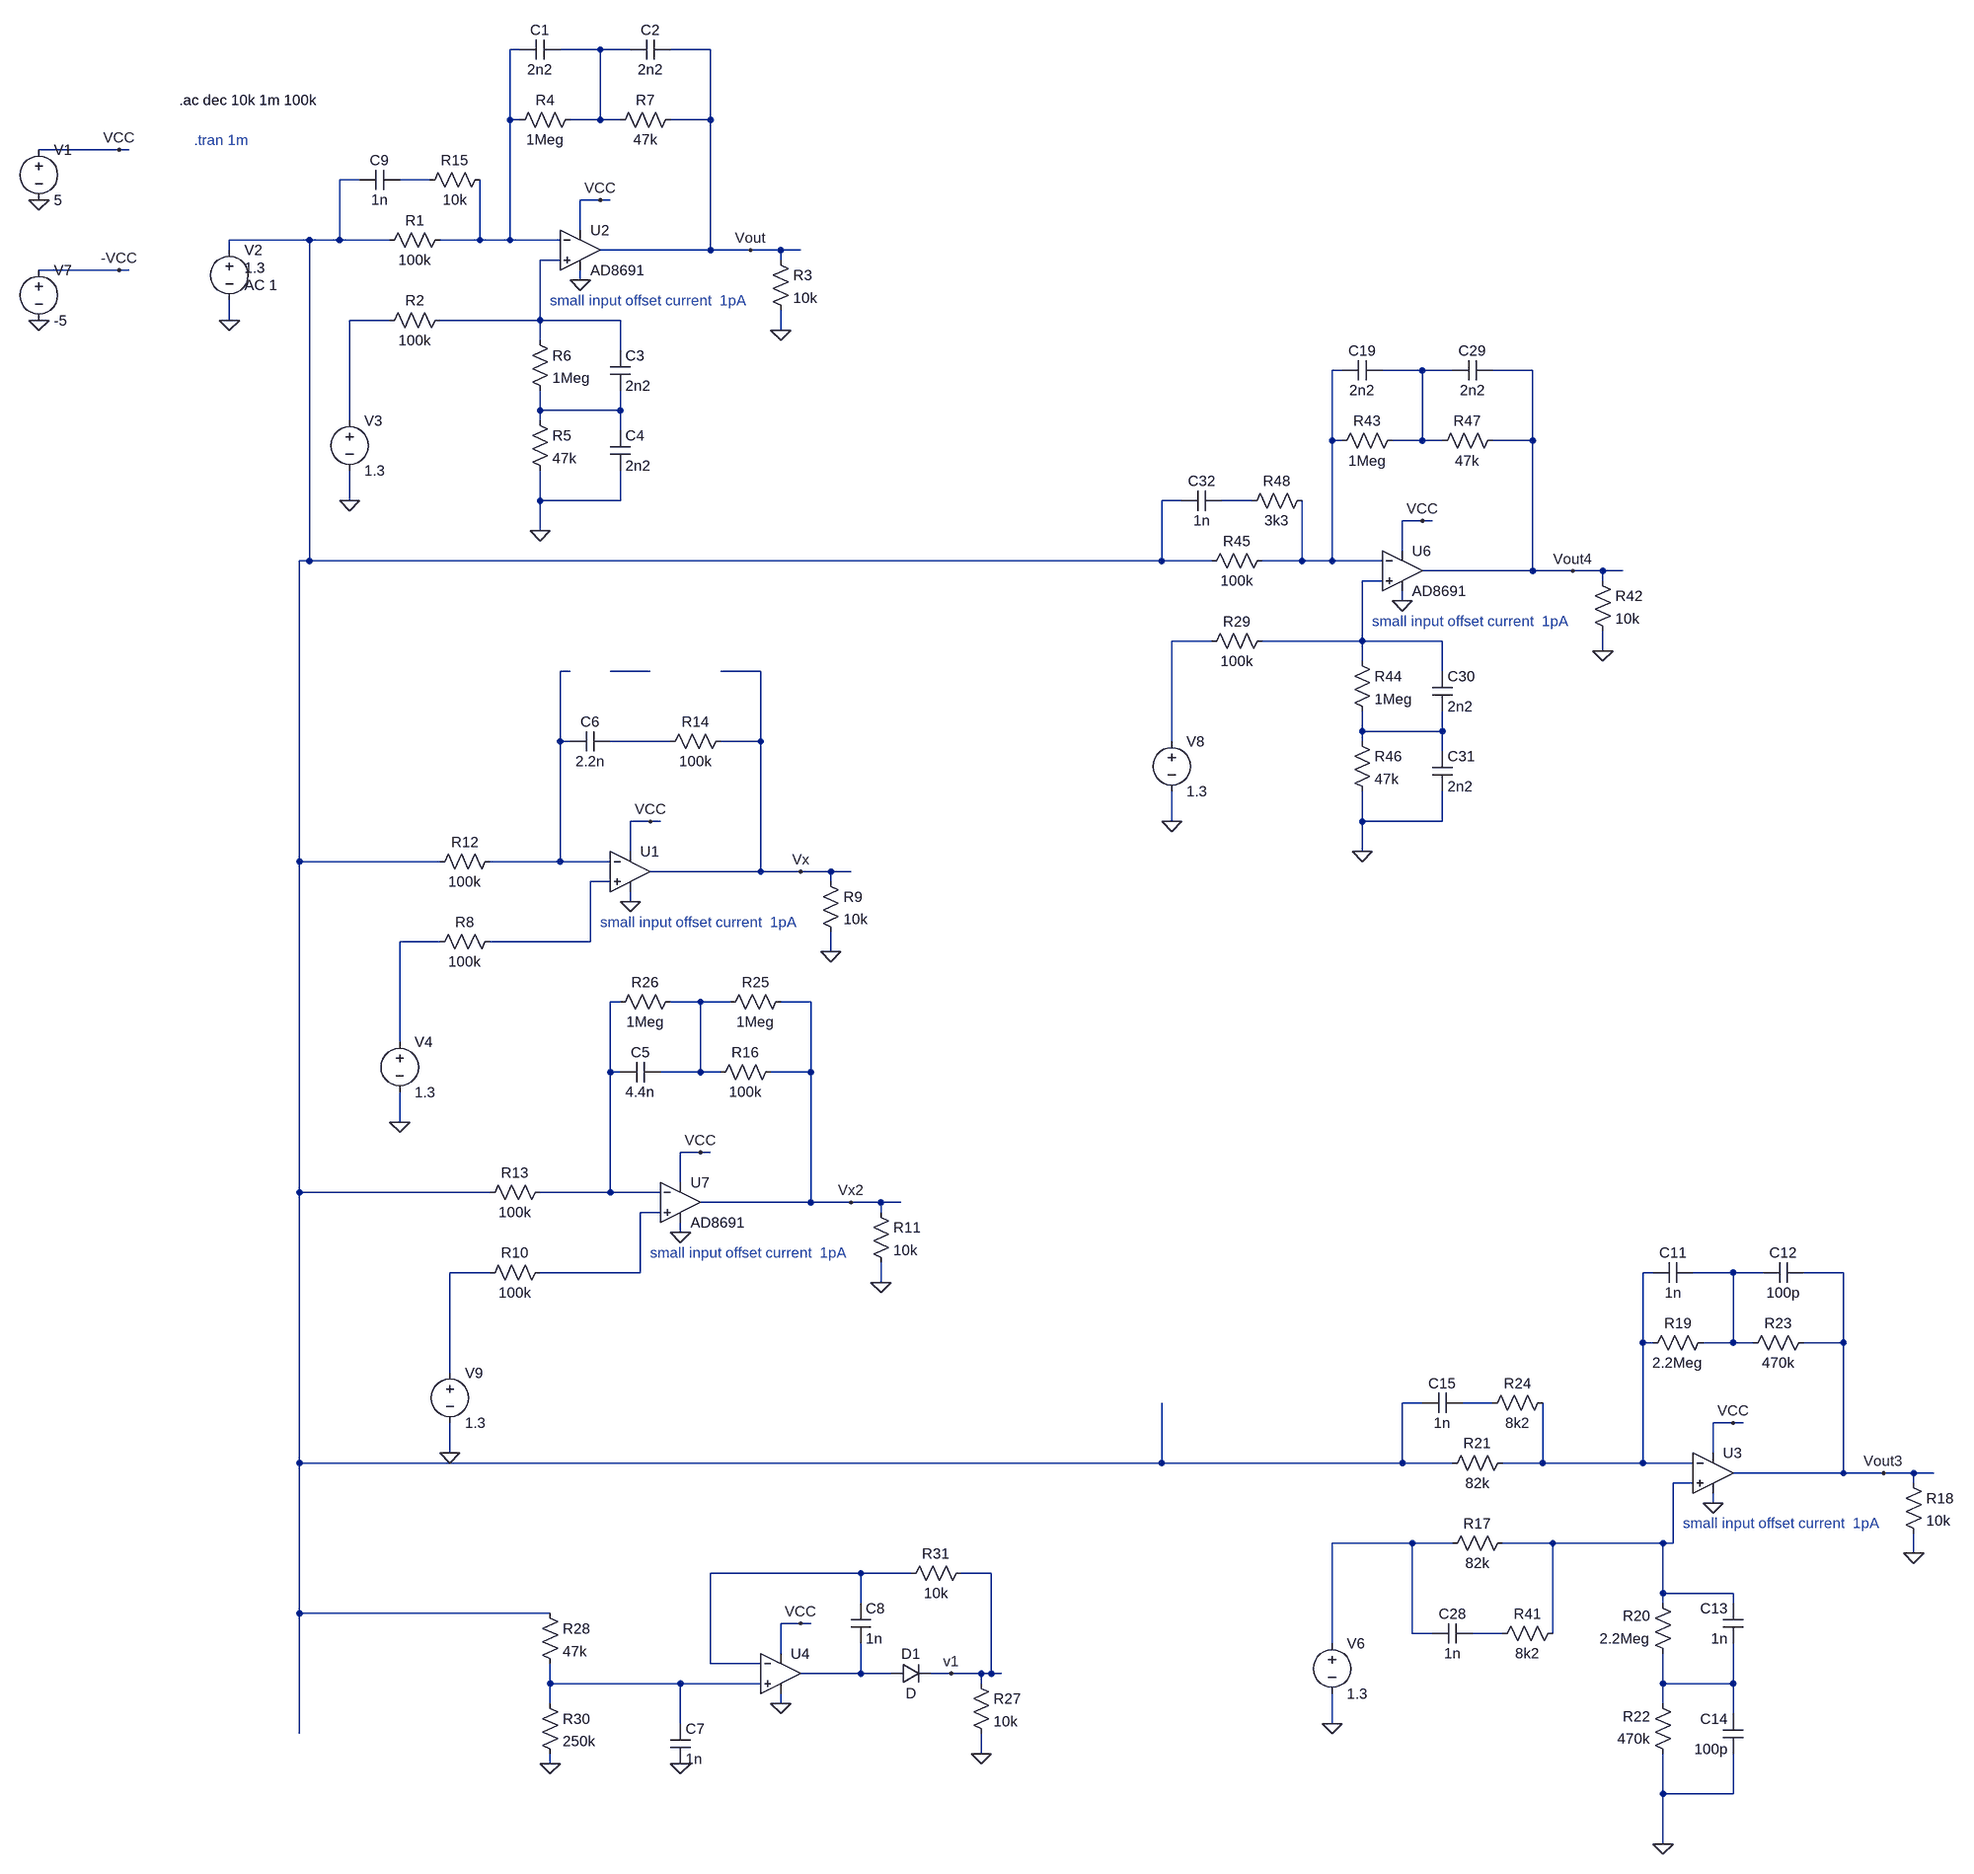
[diagram p0: schematic current controller.asc]
current controller.asc, the LTspice schematic file:
Version 4
SHEET 1 1892 2836
WIRE -400 -336 -416 -336
WIRE -272 -336 -336 -336
WIRE -224 -336 -272 -336
WIRE -96 -336 -160 -336
WIRE -416 -224 -416 -336
WIRE -400 -224 -416 -224
WIRE -272 -224 -272 -336
WIRE -272 -224 -320 -224
WIRE -240 -224 -272 -224
WIRE -96 -224 -96 -336
WIRE -96 -224 -160 -224
WIRE -1040 -176 -1168 -176
WIRE -1024 -176 -1040 -176
WIRE -656 -128 -688 -128
WIRE -544 -128 -592 -128
WIRE -272 -96 -304 -96
WIRE -256 -96 -272 -96
WIRE -304 -48 -304 -96
WIRE -736 -32 -864 -32
WIRE -688 -32 -688 -128
WIRE -688 -32 -736 -32
WIRE -608 -32 -688 -32
WIRE -464 -32 -464 -128
WIRE -464 -32 -528 -32
WIRE -416 -32 -416 -224
WIRE -416 -32 -464 -32
WIRE -336 -32 -416 -32
WIRE -864 -16 -864 -32
WIRE -96 -16 -96 -224
WIRE -96 -16 -272 -16
WIRE -32 -16 -96 -16
WIRE 16 -16 -32 -16
WIRE 48 -16 16 -16
WIRE -336 0 -368 0
WIRE 16 0 16 -16
WIRE -1040 16 -1168 16
WIRE -1024 16 -1040 16
WIRE -304 32 -304 16
WIRE -864 96 -864 64
WIRE -608 96 -672 96
WIRE -368 96 -368 0
WIRE -368 96 -528 96
WIRE -240 96 -368 96
WIRE 16 112 16 80
WIRE -368 128 -368 96
WIRE -240 144 -240 96
WIRE 912 176 896 176
WIRE 1040 176 976 176
WIRE 1088 176 1040 176
WIRE 1216 176 1152 176
WIRE -368 240 -368 208
WIRE -240 240 -240 208
WIRE -240 240 -368 240
WIRE -672 256 -672 96
WIRE -368 256 -368 240
WIRE -240 272 -240 240
WIRE 896 288 896 176
WIRE 912 288 896 288
WIRE 1040 288 1040 176
WIRE 1040 288 992 288
WIRE 1072 288 1040 288
WIRE 1216 288 1216 176
WIRE 1216 288 1152 288
WIRE -672 384 -672 336
WIRE -368 384 -368 336
WIRE -240 384 -240 336
WIRE -240 384 -368 384
WIRE 656 384 624 384
WIRE 768 384 720 384
WIRE 1040 416 1008 416
WIRE 1056 416 1040 416
WIRE -368 432 -368 384
WIRE 1008 464 1008 416
WIRE -736 480 -736 -32
WIRE -736 480 -752 480
WIRE 624 480 624 384
WIRE 624 480 -736 480
WIRE 704 480 624 480
WIRE 848 480 848 384
WIRE 848 480 784 480
WIRE 896 480 896 288
WIRE 896 480 848 480
WIRE 976 480 896 480
WIRE 1216 496 1216 288
WIRE 1216 496 1040 496
WIRE 1280 496 1216 496
WIRE 1328 496 1280 496
WIRE 1360 496 1328 496
WIRE 976 512 944 512
WIRE 1328 512 1328 496
WIRE 1008 544 1008 528
WIRE 704 608 640 608
WIRE 944 608 944 512
WIRE 944 608 784 608
WIRE 1072 608 944 608
WIRE 1328 624 1328 592
WIRE 944 640 944 608
WIRE -320 656 -336 656
WIRE -192 656 -256 656
WIRE -16 656 -80 656
WIRE 1072 656 1072 608
WIRE 944 752 944 720
WIRE 1072 752 1072 720
WIRE 1072 752 944 752
WIRE -336 768 -336 656
WIRE -320 768 -336 768
WIRE -160 768 -256 768
WIRE -16 768 -16 656
WIRE -16 768 -80 768
WIRE 640 768 640 608
WIRE 944 768 944 752
WIRE 1072 784 1072 752
WIRE -192 896 -224 896
WIRE -176 896 -192 896
WIRE 640 896 640 848
WIRE 944 896 944 848
WIRE 1072 896 1072 848
WIRE 1072 896 944 896
WIRE -224 944 -224 896
WIRE 944 944 944 896
WIRE -752 960 -752 480
WIRE -528 960 -752 960
WIRE -336 960 -336 768
WIRE -336 960 -448 960
WIRE -256 960 -336 960
WIRE -16 976 -16 768
WIRE -16 976 -192 976
WIRE 48 976 -16 976
WIRE 96 976 48 976
WIRE 128 976 96 976
WIRE -256 992 -288 992
WIRE 96 992 96 976
WIRE -224 1024 -224 1008
WIRE -528 1088 -592 1088
WIRE -288 1088 -288 992
WIRE -288 1088 -448 1088
WIRE 96 1104 96 1072
WIRE -240 1184 -256 1184
WIRE -112 1184 -160 1184
WIRE -64 1184 -112 1184
WIRE 64 1184 16 1184
WIRE -592 1248 -592 1088
WIRE -256 1296 -256 1184
WIRE -240 1296 -256 1296
WIRE -112 1296 -112 1184
WIRE -112 1296 -176 1296
WIRE -80 1296 -112 1296
WIRE 64 1296 64 1184
WIRE 64 1296 0 1296
WIRE -592 1376 -592 1328
WIRE -112 1424 -144 1424
WIRE -96 1424 -112 1424
WIRE -144 1472 -144 1424
WIRE -752 1488 -752 960
WIRE -448 1488 -752 1488
WIRE -256 1488 -256 1296
WIRE -256 1488 -368 1488
WIRE -176 1488 -256 1488
WIRE 64 1504 64 1296
WIRE 64 1504 -112 1504
WIRE 128 1504 64 1504
WIRE 176 1504 128 1504
WIRE 208 1504 176 1504
WIRE -176 1520 -208 1520
WIRE 176 1520 176 1504
WIRE -144 1552 -144 1536
WIRE -448 1616 -512 1616
WIRE -208 1616 -208 1520
WIRE -208 1616 -368 1616
WIRE 1408 1616 1392 1616
WIRE 1536 1616 1472 1616
WIRE 1584 1616 1536 1616
WIRE 1712 1616 1648 1616
WIRE 176 1632 176 1600
WIRE 1392 1728 1392 1616
WIRE 1408 1728 1392 1728
WIRE 1536 1728 1536 1616
WIRE 1536 1728 1488 1728
WIRE 1568 1728 1536 1728
WIRE 1712 1728 1712 1616
WIRE 1712 1728 1648 1728
WIRE -512 1776 -512 1616
WIRE 1040 1824 1008 1824
WIRE 1152 1824 1104 1824
WIRE 1536 1856 1504 1856
WIRE 1552 1856 1536 1856
WIRE -512 1904 -512 1856
WIRE 1504 1904 1504 1856
WIRE -752 1920 -752 1488
WIRE 624 1920 624 1824
WIRE 624 1920 -752 1920
WIRE 1008 1920 1008 1824
WIRE 1008 1920 624 1920
WIRE 1088 1920 1008 1920
WIRE 1232 1920 1232 1824
WIRE 1232 1920 1168 1920
WIRE 1392 1920 1392 1728
WIRE 1392 1920 1232 1920
WIRE 1472 1920 1392 1920
WIRE 1712 1936 1712 1728
WIRE 1712 1936 1536 1936
WIRE 1776 1936 1712 1936
WIRE 1824 1936 1776 1936
WIRE 1856 1936 1824 1936
WIRE 1472 1952 1440 1952
WIRE 1824 1952 1824 1936
WIRE 1504 1984 1504 1968
WIRE 1024 2048 896 2048
WIRE 1088 2048 1024 2048
WIRE 1248 2048 1168 2048
WIRE 1424 2048 1248 2048
WIRE 1440 2048 1440 1952
WIRE 1440 2048 1424 2048
WIRE 1824 2064 1824 2032
WIRE 144 2096 -96 2096
WIRE 224 2096 144 2096
WIRE 352 2096 304 2096
WIRE 1424 2128 1424 2048
WIRE 1536 2128 1424 2128
WIRE 144 2144 144 2096
WIRE 1424 2144 1424 2128
WIRE 1536 2144 1536 2128
WIRE -752 2160 -752 1920
WIRE -352 2160 -752 2160
WIRE 48 2176 16 2176
WIRE 64 2176 48 2176
WIRE 1024 2192 1024 2048
WIRE 1056 2192 1024 2192
WIRE 1168 2192 1120 2192
WIRE 1248 2192 1248 2048
WIRE 896 2208 896 2048
WIRE 16 2224 16 2176
WIRE -96 2240 -96 2096
WIRE -16 2240 -96 2240
WIRE 144 2256 144 2208
WIRE 144 2256 48 2256
WIRE 192 2256 144 2256
WIRE 288 2256 256 2256
WIRE 336 2256 288 2256
WIRE 352 2256 352 2096
WIRE 352 2256 336 2256
WIRE 368 2256 352 2256
WIRE -352 2272 -352 2240
WIRE -144 2272 -352 2272
WIRE -16 2272 -144 2272
WIRE 336 2272 336 2256
WIRE 1424 2272 1424 2224
WIRE 1536 2272 1536 2208
WIRE 1536 2272 1424 2272
WIRE -352 2304 -352 2272
WIRE 16 2304 16 2288
WIRE 1424 2304 1424 2272
WIRE 1536 2320 1536 2272
WIRE -144 2336 -144 2272
WIRE 896 2336 896 2288
WIRE -752 2352 -752 2160
WIRE 336 2384 336 2352
WIRE -352 2400 -352 2384
WIRE 1424 2448 1424 2384
WIRE 1536 2448 1536 2384
WIRE 1536 2448 1424 2448
WIRE 1424 2528 1424 2448
FLAG -304 32 0
FLAG -272 -96 VCC
FLAG -1168 -96 0
FLAG 16 112 0
FLAG -32 -16 Vout
FLAG -672 384 0
FLAG -368 432 0
FLAG -864 96 0
FLAG -1040 -176 VCC
FLAG 1504 1984 0
FLAG 1536 1856 VCC
FLAG 1824 2064 0
FLAG 1776 1936 Vout3
FLAG 896 2336 0
FLAG 1424 2528 0
FLAG 1008 544 0
FLAG 1040 416 VCC
FLAG 1328 624 0
FLAG 1280 496 Vout4
FLAG 640 896 0
FLAG 944 944 0
FLAG -1168 96 0
FLAG -1040 16 -VCC
FLAG -224 1024 0
FLAG -192 896 VCC
FLAG 96 1104 0
FLAG 48 976 Vx
FLAG -592 1376 0
FLAG -144 1552 0
FLAG -112 1424 VCC
FLAG 176 1632 0
FLAG 128 1504 Vx2
FLAG -512 1904 0
FLAG 16 2304 0
FLAG 48 2176 VCC
FLAG 336 2384 0
FLAG 288 2256 v1
FLAG -352 2400 0
FLAG -144 2400 0
SYMBOL voltage -1168 -192 R0
WINDOW 123 0 0 Left 0
WINDOW 39 0 0 Left 0
SYMATTR InstName V1
SYMATTR Value 5
SYMBOL res -512 80 R90
WINDOW 0 0 56 VBottom 2
WINDOW 3 32 56 VTop 2
SYMATTR InstName R2
SYMATTR Value 100k
SYMBOL res 0 -16 R0
SYMATTR InstName R3
SYMATTR Value 10k
SYMBOL res -304 -240 R90
WINDOW 0 0 56 VBottom 2
WINDOW 3 32 56 VTop 2
SYMATTR InstName R4
SYMATTR Value 1Meg
SYMBOL voltage -672 240 R0
WINDOW 123 0 0 Left 0
WINDOW 39 0 0 Left 0
SYMATTR InstName V3
SYMATTR Value 1.3
SYMBOL res -384 112 R0
SYMATTR InstName R6
SYMATTR Value 1Meg
SYMBOL OpAmps\\AD8691 -304 -80 R0
SYMATTR InstName U2
SYMBOL res -512 -48 R90
WINDOW 0 0 56 VBottom 2
WINDOW 3 32 56 VTop 2
SYMATTR InstName R1
SYMATTR Value 100k
SYMBOL res -384 240 R0
SYMATTR InstName R5
SYMATTR Value 47k
SYMBOL res -144 -240 R90
WINDOW 0 0 56 VBottom 2
WINDOW 3 32 56 VTop 2
SYMATTR InstName R7
SYMATTR Value 47k
SYMBOL voltage -864 -32 R0
WINDOW 3 24 44 Left 2
WINDOW 123 24 72 Left 2
WINDOW 39 0 0 Left 0
SYMATTR Value 1.3
SYMATTR Value2 AC 1
SYMATTR InstName V2
SYMBOL cap -336 -352 R90
WINDOW 0 0 32 VBottom 2
WINDOW 3 32 32 VTop 2
SYMATTR InstName C1
SYMATTR Value 2n2
SYMBOL cap -160 -352 R90
WINDOW 0 0 32 VBottom 2
WINDOW 3 32 32 VTop 2
SYMATTR InstName C2
SYMATTR Value 2n2
SYMBOL cap -256 144 R0
SYMATTR InstName C3
SYMATTR Value 2n2
SYMBOL cap -256 272 R0
SYMATTR InstName C4
SYMATTR Value 2n2
SYMBOL cap -592 -144 R90
WINDOW 0 0 32 VBottom 2
WINDOW 3 32 32 VTop 2
SYMATTR InstName C9
SYMATTR Value 1n
SYMBOL res -448 -144 R90
WINDOW 0 0 56 VBottom 2
WINDOW 3 32 56 VTop 2
SYMATTR InstName R15
SYMATTR Value 10k
SYMBOL res 1184 2032 R90
WINDOW 0 0 56 VBottom 2
WINDOW 3 32 56 VTop 2
SYMATTR InstName R17
SYMATTR Value 82k
SYMBOL res 1808 1936 R0
SYMATTR InstName R18
SYMATTR Value 10k
SYMBOL res 1504 1712 R90
WINDOW 0 0 56 VBottom 2
WINDOW 3 32 56 VTop 2
SYMATTR InstName R19
SYMATTR Value 2.2Meg
SYMBOL voltage 896 2192 R0
WINDOW 123 0 0 Left 0
WINDOW 39 0 0 Left 0
SYMATTR InstName V6
SYMATTR Value 1.3
SYMBOL res 1184 1904 R90
WINDOW 0 0 56 VBottom 2
WINDOW 3 32 56 VTop 2
SYMATTR InstName R21
SYMATTR Value 82k
SYMBOL res 1664 1712 R90
WINDOW 0 0 56 VBottom 2
WINDOW 3 32 56 VTop 2
SYMATTR InstName R23
SYMATTR Value 470k
SYMBOL cap 1472 1600 R90
WINDOW 0 0 32 VBottom 2
WINDOW 3 32 32 VTop 2
SYMATTR InstName C11
SYMATTR Value 1n
SYMBOL cap 1648 1600 R90
WINDOW 0 0 32 VBottom 2
WINDOW 3 32 32 VTop 2
SYMATTR InstName C12
SYMATTR Value 100p
SYMBOL cap 1104 1808 R90
WINDOW 0 0 32 VBottom 2
WINDOW 3 32 32 VTop 2
SYMATTR InstName C15
SYMATTR Value 1n
SYMBOL res 1248 1808 R90
WINDOW 0 0 56 VBottom 2
WINDOW 3 32 56 VTop 2
SYMATTR InstName R24
SYMATTR Value 8k2
SYMBOL res 1440 2240 R180
WINDOW 0 36 76 Left 2
WINDOW 3 36 40 Left 2
SYMATTR InstName R20
SYMATTR Value 2.2Meg
SYMBOL res 1440 2400 R180
WINDOW 0 36 76 Left 2
WINDOW 3 36 40 Left 2
SYMATTR InstName R22
SYMATTR Value 470k
SYMBOL cap 1552 2208 R180
WINDOW 0 24 56 Left 2
WINDOW 3 24 8 Left 2
SYMATTR InstName C13
SYMATTR Value 1n
SYMBOL cap 1552 2384 R180
WINDOW 0 24 56 Left 2
WINDOW 3 24 8 Left 2
SYMATTR InstName C14
SYMATTR Value 100p
SYMBOL OpAmps\\UniversalOpAmp 1504 1936 R0
SYMATTR InstName U3
SYMBOL cap 1120 2176 R90
WINDOW 0 0 32 VBottom 2
WINDOW 3 32 32 VTop 2
SYMATTR InstName C28
SYMATTR Value 1n
SYMBOL res 1264 2176 R90
WINDOW 0 0 56 VBottom 2
WINDOW 3 32 56 VTop 2
SYMATTR InstName R41
SYMATTR Value 8k2
SYMBOL res 800 592 R90
WINDOW 0 0 56 VBottom 2
WINDOW 3 32 56 VTop 2
SYMATTR InstName R29
SYMATTR Value 100k
SYMBOL res 1312 496 R0
SYMATTR InstName R42
SYMATTR Value 10k
SYMBOL res 1008 272 R90
WINDOW 0 0 56 VBottom 2
WINDOW 3 32 56 VTop 2
SYMATTR InstName R43
SYMATTR Value 1Meg
SYMBOL voltage 640 752 R0
WINDOW 123 0 0 Left 0
WINDOW 39 0 0 Left 0
SYMATTR InstName V8
SYMATTR Value 1.3
SYMBOL res 928 624 R0
SYMATTR InstName R44
SYMATTR Value 1Meg
SYMBOL OpAmps\\AD8691 1008 432 R0
SYMATTR InstName U6
SYMBOL res 800 464 R90
WINDOW 0 0 56 VBottom 2
WINDOW 3 32 56 VTop 2
SYMATTR InstName R45
SYMATTR Value 100k
SYMBOL res 928 752 R0
SYMATTR InstName R46
SYMATTR Value 47k
SYMBOL res 1168 272 R90
WINDOW 0 0 56 VBottom 2
WINDOW 3 32 56 VTop 2
SYMATTR InstName R47
SYMATTR Value 47k
SYMBOL cap 976 160 R90
WINDOW 0 0 32 VBottom 2
WINDOW 3 32 32 VTop 2
SYMATTR InstName C19
SYMATTR Value 2n2
SYMBOL cap 1152 160 R90
WINDOW 0 0 32 VBottom 2
WINDOW 3 32 32 VTop 2
SYMATTR InstName C29
SYMATTR Value 2n2
SYMBOL cap 1056 656 R0
SYMATTR InstName C30
SYMATTR Value 2n2
SYMBOL cap 1056 784 R0
SYMATTR InstName C31
SYMATTR Value 2n2
SYMBOL cap 720 368 R90
WINDOW 0 0 32 VBottom 2
WINDOW 3 32 32 VTop 2
SYMATTR InstName C32
SYMATTR Value 1n
SYMBOL res 864 368 R90
WINDOW 0 0 56 VBottom 2
WINDOW 3 32 56 VTop 2
SYMATTR InstName R48
SYMATTR Value 3k3
SYMBOL voltage -1168 0 R0
WINDOW 123 0 0 Left 0
WINDOW 39 0 0 Left 0
SYMATTR InstName V7
SYMATTR Value -5
SYMBOL res -432 1072 R90
WINDOW 0 0 56 VBottom 2
WINDOW 3 32 56 VTop 2
SYMATTR InstName R8
SYMATTR Value 100k
SYMBOL res 80 976 R0
SYMATTR InstName R9
SYMATTR Value 10k
SYMBOL voltage -592 1232 R0
WINDOW 123 0 0 Left 0
WINDOW 39 0 0 Left 0
SYMATTR InstName V4
SYMATTR Value 1.3
SYMBOL res -432 944 R90
WINDOW 0 0 56 VBottom 2
WINDOW 3 32 56 VTop 2
SYMATTR InstName R12
SYMATTR Value 100k
SYMBOL res -64 752 R90
WINDOW 0 0 56 VBottom 2
WINDOW 3 32 56 VTop 2
SYMATTR InstName R14
SYMATTR Value 100k
SYMBOL cap -256 752 R90
WINDOW 0 0 32 VBottom 2
WINDOW 3 32 32 VTop 2
SYMATTR InstName C6
SYMATTR Value 2.2n
SYMBOL OpAmps\\UniversalOpAmp1 -224 976 R0
SYMATTR InstName U1
SYMBOL res -352 1600 R90
WINDOW 0 0 56 VBottom 2
WINDOW 3 32 56 VTop 2
SYMATTR InstName R10
SYMATTR Value 100k
SYMBOL res 160 1504 R0
SYMATTR InstName R11
SYMATTR Value 10k
SYMBOL voltage -512 1760 R0
WINDOW 123 0 0 Left 0
WINDOW 39 0 0 Left 0
SYMATTR InstName V9
SYMATTR Value 1.3
SYMBOL res -352 1472 R90
WINDOW 0 0 56 VBottom 2
WINDOW 3 32 56 VTop 2
SYMATTR InstName R13
SYMATTR Value 100k
SYMBOL res 16 1280 R90
WINDOW 0 0 56 VBottom 2
WINDOW 3 32 56 VTop 2
SYMATTR InstName R16
SYMATTR Value 100k
SYMBOL cap -176 1280 R90
WINDOW 0 0 32 VBottom 2
WINDOW 3 32 32 VTop 2
SYMATTR InstName C5
SYMATTR Value 4.4n
SYMBOL res 32 1168 R90
WINDOW 0 0 56 VBottom 2
WINDOW 3 32 56 VTop 2
SYMATTR InstName R25
SYMATTR Value 1Meg
SYMBOL OpAmps\\AD8691 -144 1440 R0
SYMATTR InstName U7
SYMBOL res -144 1168 R90
WINDOW 0 0 56 VBottom 2
WINDOW 3 32 56 VTop 2
SYMATTR InstName R26
SYMATTR Value 1Meg
SYMBOL res 320 2256 R0
SYMATTR InstName R27
SYMATTR Value 10k
SYMBOL res -368 2144 R0
SYMATTR InstName R28
SYMATTR Value 47k
SYMBOL res -368 2288 R0
SYMATTR InstName R30
SYMATTR Value 250k
SYMBOL cap -160 2336 R0
SYMATTR InstName C7
SYMATTR Value 1n
SYMBOL cap 128 2144 R0
SYMATTR InstName C8
SYMATTR Value 1n
SYMBOL OpAmps\\UniversalOpAmp1 16 2256 R0
SYMATTR InstName U4
SYMBOL res 320 2080 R90
WINDOW 0 0 56 VBottom 2
WINDOW 3 32 56 VTop 2
SYMATTR InstName R31
SYMATTR Value 10k
SYMBOL diode 192 2272 R270
WINDOW 0 32 32 VTop 2
WINDOW 3 0 32 VBottom 2
SYMATTR InstName D1
TEXT -944 -256 Left 2 !.ac dec 10k 1m 100k
TEXT -352 64 Left 2 ;small input offset current  1pA
TEXT 1456 2016 Left 2 ;small input offset current  1pA
TEXT -920 -192 Left 2 ;.tran 1m
TEXT 960 576 Left 2 ;small input offset current  1pA
TEXT -272 1056 Left 2 ;small input offset current  1pA
TEXT -192 1584 Left 2 ;small input offset current  1pA

The netlist it stands for:
* current controller.asc
V1 VCC 0 5
R2 N005 N006 100k
R3 Vout 0 10k
R4 N002 N001 1Meg
V3 N006 0 1.3
R6 N005 N009 1Meg
XU2 N005 N001 VCC 0 Vout AD8691  ; pins In+ In- V+ V- OUT
R1 N001 N003 100k
R5 N009 0 47k
R7 Vout N002 47k
V2 N003 0 1.3 AC 1
C1 N002 N001 2n2
C2 Vout N002 2n2
C3 N005 N009 2n2
C4 N009 0 2n2
C9 N004 N003 1n
R15 N001 N004 10k
R17 N026 N027 82k
R18 Vout3 0 10k
R19 N024 N023 2.2Meg
V6 N027 0 1.3
R21 N023 N003 82k
R23 Vout3 N024 470k
C11 N024 N023 1n
C12 Vout3 N024 100p
C15 N025 N003 1n
R24 N023 N025 8k2
R20 N032 N026 2.2Meg
R22 0 N032 470k
C13 N032 N026 1n
C14 0 N032 100p
XU3 N026 N023 VCC 0 Vout3 level1 Avol=1Meg GBW=10Meg Vos=0 En=0 Enk=0 In=0 Ink=0 Rin=500Meg  ; pins In+ In- V+ V- OUT
C28 N029 N027 1n
R41 N026 N029 8k2
R29 N011 N012 100k
R42 Vout4 0 10k
R43 N008 N007 1Meg
V8 N012 0 1.3
R44 N011 N015 1Meg
XU6 N011 N007 VCC 0 Vout4 AD8691  ; pins In+ In- V+ V- OUT
R45 N007 N003 100k
R46 N015 0 47k
R47 Vout4 N008 47k
C19 N008 N007 2n2
C29 Vout4 N008 2n2
C30 N011 N015 2n2
C31 N015 0 2n2
C32 N010 N003 1n
R48 N007 N010 3k3
V7 -VCC 0 -5
R8 N017 N018 100k
R9 Vx 0 10k
V4 N018 0 1.3
R12 N013 N003 100k
R14 Vx N016 100k
C6 N016 N013 2.2n
XU1 N017 N013 VCC 0 Vx level1 Avol=1Meg GBW=10Meg Vos=0 En=0 Enk=0 In=0 Ink=0 Rin=500Meg  ; pins In+ In- V+ V- OUT
R10 N021 N022 100k
R11 Vx2 0 10k
V9 N022 0 1.3
R13 N019 N003 100k
R16 Vx2 N020 100k
C5 N020 N019 4.4n
R25 Vx2 N020 1Meg
XU7 N021 N019 VCC 0 Vx2 AD8691  ; pins In+ In- V+ V- OUT
R26 N020 N019 1Meg
R27 v1 0 10k
R28 N003 N031 47k
R30 N031 0 250k
C7 N031 0 1n
C8 N028 N030 1n
XU4 N031 N028 VCC 0 N030 level1 Avol=1Meg GBW=10Meg Vos=0 En=0 Enk=0 In=0 Ink=0 Rin=500Meg  ; pins In+ In- V+ V- OUT
R31 v1 N028 10k
D1 N030 v1 D
.model D D
.lib standard.dio
.ac dec 10k 1m 100k
* small input offset current  1pA
* small input offset current  1pA
* .tran 1m
* small input offset current  1pA
* small input offset current  1pA
* small input offset current  1pA
.lib UniversalOpAmp1.lib
.backanno
.end